# Altium schematic sheet External Connectors.SchDoc
size A3; SheetNumber: 3; SheetTotal: 4
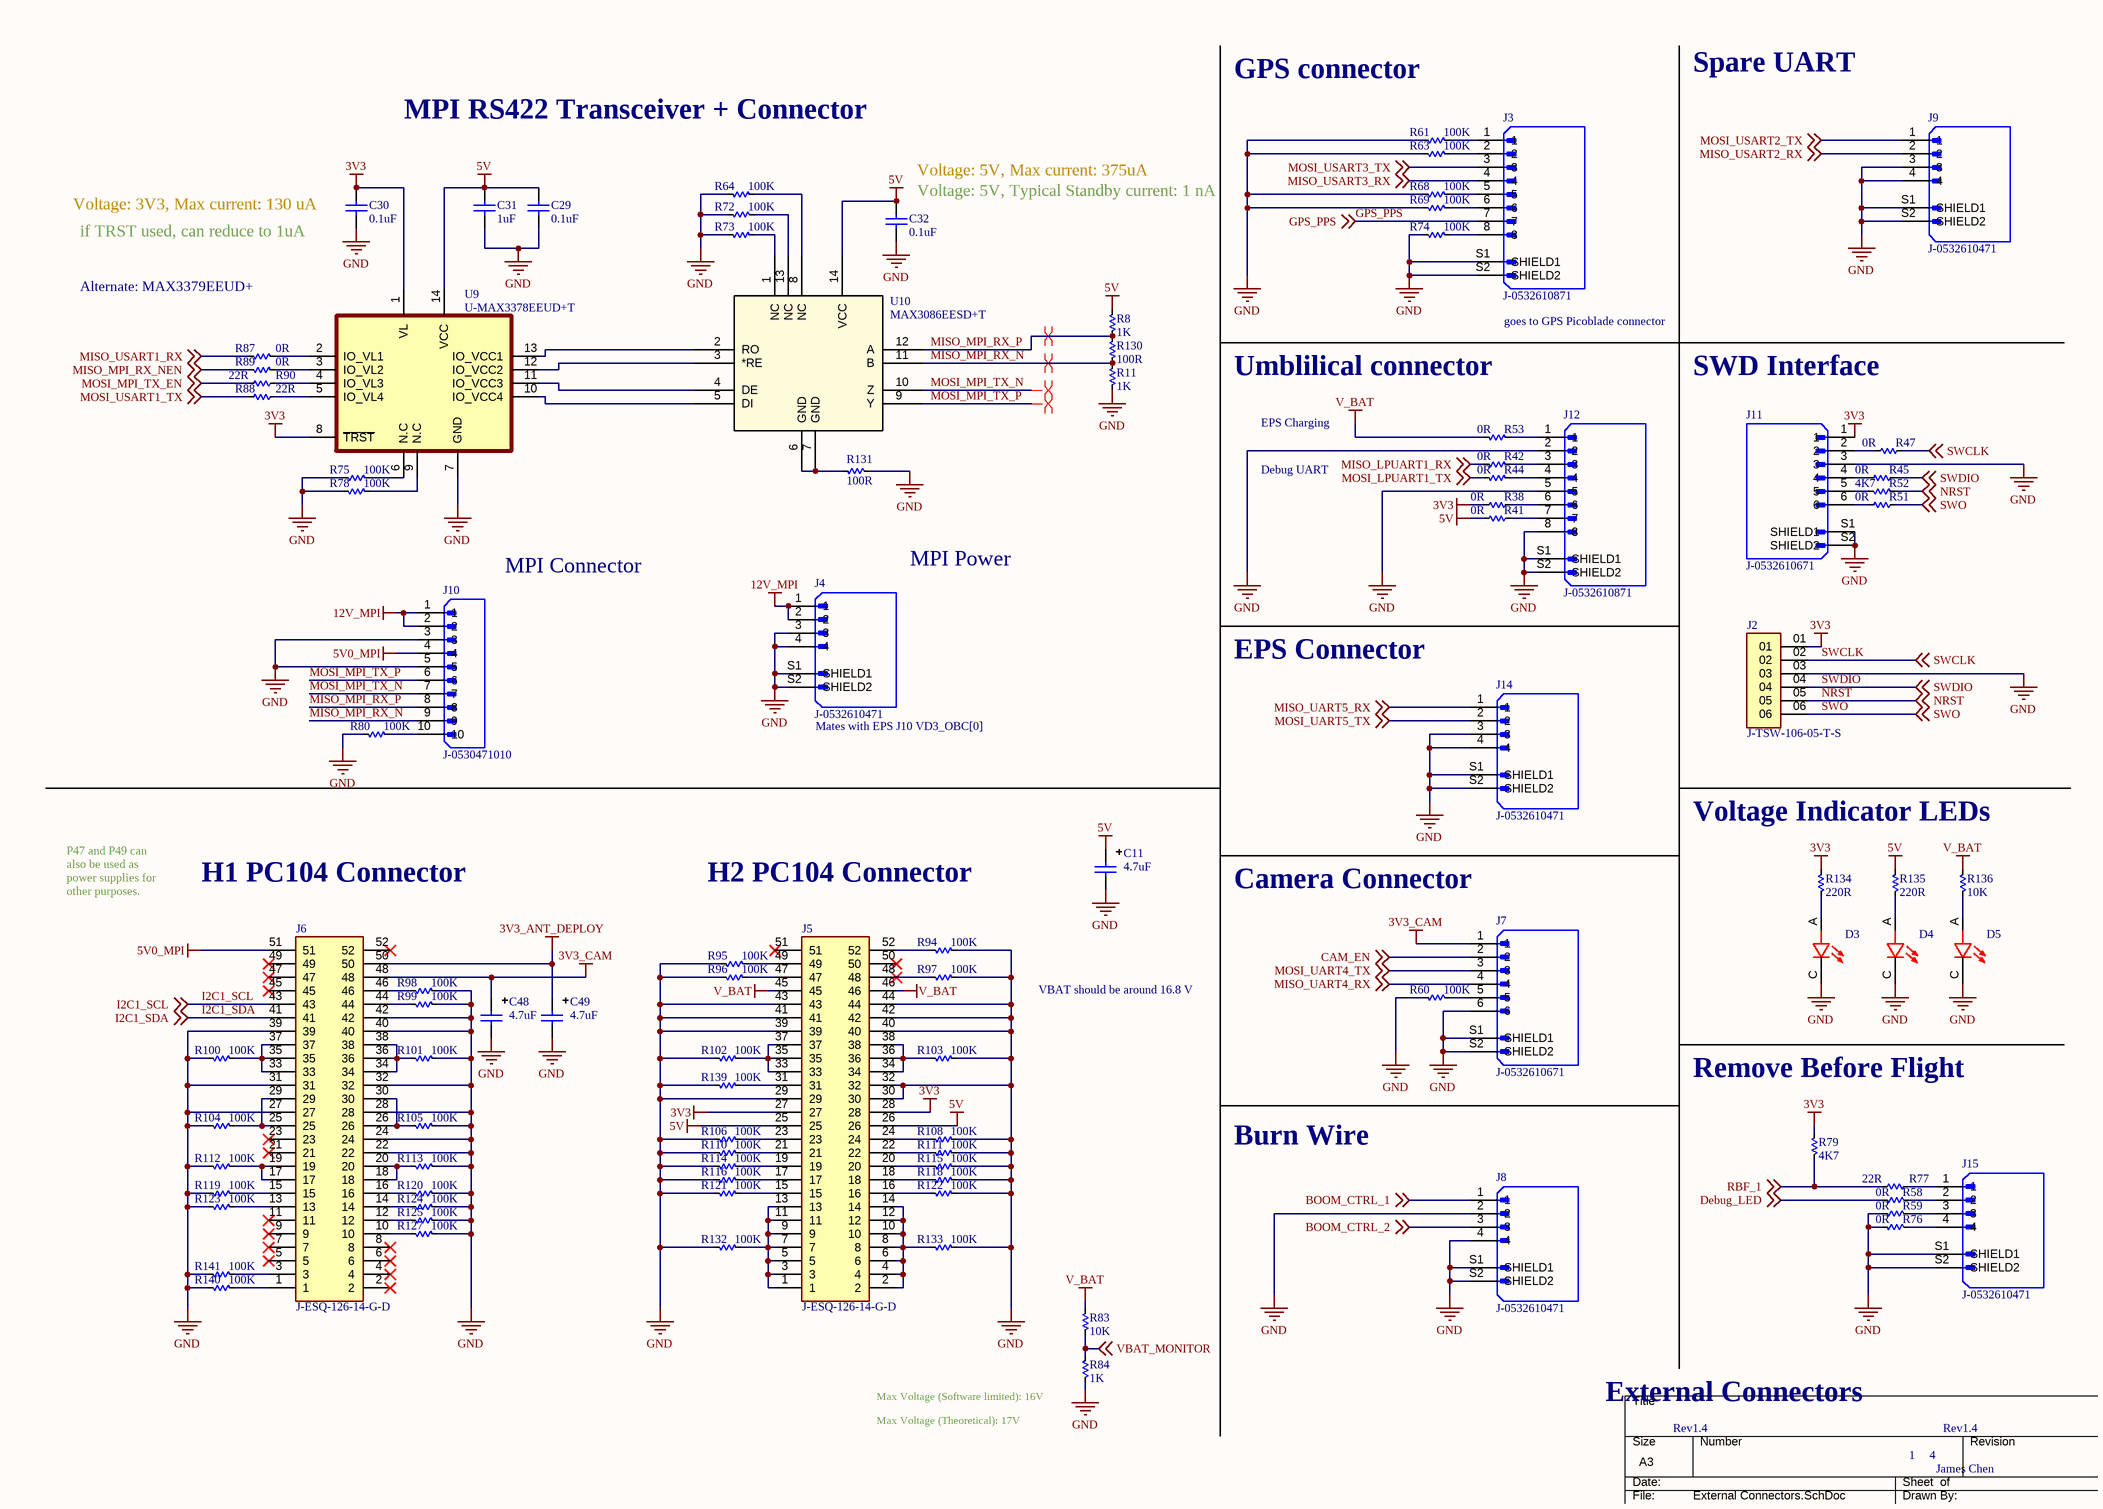
[diagram p0: External Connectors.SchDoc]

## Parts
C11  4.7uF  [CAP TANT 1206 (A) TCJ]
C29  0.1uF  [0603]
C30  0.1uF  [0603]
C31  1uF  [0603]
C32  0.1uF  [0603]
C48  4.7uF  [CAP TANT 1206 (A) TCJ]
C49  4.7uF  [CAP TANT 1206 (A) TCJ]
D3  D-SML-D12U1WT86  [D-SML-D12U1WT86]  (value not drawn)
D4  D-SML-D12U1WT86  [D-SML-D12U1WT86]  (value not drawn)
D5  D-SML-D12U1WT86  [D-SML-D12U1WT86]  (value not drawn)
J2  J-TSW-106-05-T-S  [J-TSW-106-05-T-S]
J3  J-0532610871  [J-532610871]
J4  J-0532610471  [J-53261-0471]
J5  J-ESQ-126-14-G-D  [J-ESQ-126-14-G-D]
J6  J-ESQ-126-14-G-D  [J-ESQ-126-14-G-D]
J7  J-0532610671  [J-0532610671]
J8  J-0532610471  [J-53261-0471]
J9  J-0532610471  [J-53261-0471]
J10  J-0530471010  [J-0530471010]
J11  J-0532610671  [J-0532610671]
J12  J-0532610871  [J-532610871]
J14  J-0532610471  [J-53261-0471]
J15  J-0532610471  [J-53261-0471]
R8  1K  [0603]
R11  1K  [0603]
R38  0R  [0603]
R41  0R  [0603]
R42  0R  [0603]
R44  0R  [0603]
R45  0R  [0603]
R47  0R  [0603]
R51  0R  [0603]
R52  4K7  [0603]
R53  0R  [0603]
R58  0R  [0603]
R59  0R  [0603]
R60  100K  [0603]  (value not drawn)
R61  100K  [0603]  (value not drawn)
R63  100K  [0603]  (value not drawn)
R64  100K  [0603]  (value not drawn)
R68  100K  [0603]  (value not drawn)
R69  100K  [0603]  (value not drawn)
R72  100K  [0603]  (value not drawn)
R73  100K  [0603]  (value not drawn)
R74  100K  [0603]  (value not drawn)
R75  100K  [0603]  (value not drawn)
R76  0R  [0603]
R77  22R  [0603]
R78  100K  [0603]  (value not drawn)
R79  4K7  [0603]
R80  100K  [0603]  (value not drawn)
R83  10K  [0603]
R84  1K  [0603]
R87  0R  [0603]
R88  22R  [0603]
R89  0R  [0603]
R90  22R  [0603]
R94  100K  [0603]  (value not drawn)
R95  100K  [0603]  (value not drawn)
R96  100K  [0603]  (value not drawn)
R97  100K  [0603]  (value not drawn)
R98  100K  [0603]  (value not drawn)
R99  100K  [0603]  (value not drawn)
R100  100K  [0603]  (value not drawn)
R101  100K  [0603]  (value not drawn)
R102  100K  [0603]  (value not drawn)
R103  100K  [0603]  (value not drawn)
R104  100K  [0603]  (value not drawn)
R105  100K  [0603]  (value not drawn)
R106  100K  [0603]  (value not drawn)
R108  100K  [0603]  (value not drawn)
R110  100K  [0603]  (value not drawn)
R111  100K  [0603]  (value not drawn)
R112  100K  [0603]  (value not drawn)
R113  100K  [0603]  (value not drawn)
R114  100K  [0603]  (value not drawn)
R115  100K  [0603]  (value not drawn)
R116  100K  [0603]  (value not drawn)
R118  100K  [0603]  (value not drawn)
R119  100K  [0603]  (value not drawn)
R120  100K  [0603]  (value not drawn)
R121  100K  [0603]  (value not drawn)
R122  100K  [0603]  (value not drawn)
R123  100K  [0603]  (value not drawn)
R124  100K  [0603]  (value not drawn)
R125  100K  [0603]  (value not drawn)
R127  100K  [0603]  (value not drawn)
R130  100R  [0603]
R131  100R  [0603]
R132  100K  [0603]  (value not drawn)
R133  100K  [0603]  (value not drawn)
R134  220R  [0603]
R135  220R  [0603]
R136  10K  [0603]
R139  100K  [0603]  (value not drawn)
R140  100K  [0603]  (value not drawn)
R141  100K  [0603]  (value not drawn)
U9  U-MAX3378EEUD+T  [U-MAX3378EEUD+T]
U10  MAX3086EESD+T  [U-MAX3086EESD+T]

## Nets
3V3: C30.1 J2.01 J5.27 J5.28 J11.1 R38.2 R79.2 R134.2 U9.1(VL) U9.8(~{TRST})
3V3_ANT_DEPLOY: C49.1 J6.50
3V3_CAM: C48.1 J6.48 J7.1
5V: C11.1 C29.1 C31.2 C32.1 J5.25 J5.26 R8.2 R41.2 R135.2 U9.14(VCC) U10.14(VCC)
5V0_MPI: J6.51 J10.4
12V_MPI: J4.1 J4.2 J10.1 J10.2
GND: C11.2 C29.2 C30.2 C31.1 C32.2 C48.2 C49.2 D3.C D4.C D5.C J2.03 J3.S1(SHIELD1) J3.S2(SHIELD2) J4.3 J4.4 J4.S1(SHIELD1) J4.S2(SHIELD2) J5.29 J5.30 J5.32 J5.39 J5.40 J5.41 J5.42 J5.43 J5.44 J6.22 J6.24 J6.27 J6.28 J6.31 J6.32 J6.39 J6.40 J6.42 J7.6 J7.S1(SHIELD1) J7.S2(SHIELD2) J8.2 J8.4 J8.S1(SHIELD1) J8.S2(SHIELD2) J9.3 J9.4 J9.S1(SHIELD1) J9.S2(SHIELD2) J10.3 J10.5 J11.3 J11.S1(SHIELD1) J11.S2(SHIELD2) J12.2 J12.5 J12.8 J12.S1(SHIELD1) J12.S2(SHIELD2) J14.3 J14.4 J14.S1(SHIELD1) J14.S2(SHIELD2) J15.S1(SHIELD1) J15.S2(SHIELD2) R11.1 R59.1 R60.1 R61.1 R63.1 R64.1 R68.1 R69.1 R72.1 R73.1 R74.1 R75.1 R76.1 R78.1 R80.1 R84.1 R94.2 R95.1 R96.1 R97.2 R98.2 R99.2 R100.1 R101.2 R102.1 R103.2 R104.1 R105.2 R106.1 R108.2 R110.1 R111.2 R112.1 R113.2 R114.1 R115.2 R116.1 R118.2 R119.1 R120.2 R121.1 R122.2 R123.1 R124.2 R125.2 R127.2 R131.1 R132.1 R133.2 R139.1 R140.1 R141.1 U9.7(GND)
V_BAT: J5.45 J5.46 R53.1 R83.2 R136.2
BOOM_CTRL_1: J8.1 ; off-sheet BOOM_CTRL_1
BOOM_CTRL_2: J8.3 ; off-sheet BOOM_CTRL_2
CAM_EN: J7.2 ; off-sheet CAM_EN
Debug_LED: R58.1 ; off-sheet Debug_LED
GPS_PPS: J3.7 ; off-sheet GPS_PPS
I2C1_SCL: J6.43 ; off-sheet I2C1_SCL
I2C1_SDA: J6.41 ; off-sheet I2C1_SDA
MISO_LPUART1_RX: R42.1 ; off-sheet MISO_LPUART1_RX
MISO_MPI_RX_N: J10.9 R11.2 R130.1 U10.11(B)
MISO_MPI_RX_NEN: R89.1 ; off-sheet MISO_MPI_RX_NEN
MISO_MPI_RX_P: J10.8 R8.1 R130.2 U10.12(A)
MISO_UART4_RX: J7.4 ; off-sheet MISO_UART4_RX
MISO_UART5_RX: J14.1 ; off-sheet MISO_UART5_RX
MISO_USART1_RX: R87.1 ; off-sheet MISO_USART1_RX
MISO_USART2_RX: J9.2 ; off-sheet MISO_USART2_RX
MISO_USART3_RX: J3.4 ; off-sheet MISO_USART3_RX
MOSI_LPUART1_TX: R44.1 ; off-sheet MOSI_LPUART1_TX
MOSI_MPI_TX_EN: R90.1 ; off-sheet MOSI_MPI_TX_EN
MOSI_MPI_TX_N: J10.7 U10.10(Z)
MOSI_MPI_TX_P: J10.6 U10.9(Y)
MOSI_UART4_TX: J7.3 ; off-sheet MOSI_UART4_TX
MOSI_UART5_TX: J14.2 ; off-sheet MOSI_UART5_TX
MOSI_USART1_TX: R88.2 ; off-sheet MOSI_USART1_TX
MOSI_USART2_TX: J9.1 ; off-sheet MOSI_USART2_TX
MOSI_USART3_TX: J3.3 ; off-sheet MOSI_USART3_TX
NRST: J2.05 R52.1 ; off-sheet NRST
RBF_1: R77.1 R79.1 ; off-sheet RBF_1
SWCLK: J2.02 R47.1 ; off-sheet SWCLK
SWDIO: J2.04 R45.1 ; off-sheet SWDIO
SWO: J2.06 R51.1 ; off-sheet SWO
VBAT_MONITOR: R83.1 R84.2 ; off-sheet VBAT_MONITOR
NetD3_A: D3.A R134.1
NetD4_A: D4.A R135.1
NetD5_A: D5.A R136.1
NetJ3_1: J3.1 R61.2
NetJ3_2: J3.2 R63.2
NetJ3_5: J3.5 R68.2
NetJ3_6: J3.6 R69.2
NetJ3_8: J3.8 R74.2
NetJ5_1: J5.1 J5.3 J5.5 J5.7 J5.9 J5.11 J5.13 R132.2
NetJ5_2: J5.2 J5.4 J5.6 J5.8 J5.10 J5.12 J5.14 R133.1
NetJ5_15: J5.15 R121.2
NetJ5_16: J5.16 R122.1
NetJ5_17: J5.17 R116.2
NetJ5_18: J5.18 R118.1
NetJ5_19: J5.19 R114.2
NetJ5_20: J5.20 R115.1
NetJ5_21: J5.21 R110.2
NetJ5_22: J5.22 R111.1
NetJ5_23: J5.23 R106.2
NetJ5_24: J5.24 R108.1
NetJ5_31: J5.31 R139.2
NetJ5_33: J5.33 J5.35 J5.37 R102.2
NetJ5_34: J5.34 J5.36 J5.38 R103.1
NetJ5_47: J5.47 R96.2
NetJ5_48: J5.48 R97.1
NetJ5_49: J5.49 R95.2
NetJ5_52: J5.52 R94.1
NetJ6_1: J6.1 R140.2
NetJ6_3: J6.3 R141.2
NetJ6_10: J6.10 R127.1
NetJ6_12: J6.12 R125.1
NetJ6_13: J6.13 R123.2
NetJ6_14: J6.14 R124.1
NetJ6_15: J6.15 R119.2
NetJ6_16: J6.16 R120.1
NetJ6_17: J6.17 J6.19 R112.2
NetJ6_18: J6.18 J6.20 R113.1
NetJ6_25: J6.25 J6.29 R104.2
NetJ6_26: J6.26 J6.30 R105.1
NetJ6_33: J6.33 J6.35 J6.37 R100.2
NetJ6_34: J6.34 J6.36 J6.38 R101.1
NetJ6_44: J6.44 R99.1
NetJ6_46: J6.46 R98.1
NetJ7_5: J7.5 R60.2
NetJ10_10: J10.10 R80.2
NetJ11_2: J11.2 R47.2
NetJ11_4: J11.4 R45.2
NetJ11_5: J11.5 R52.2
NetJ11_6: J11.6 R51.2
NetJ12_1: J12.1 R53.2
NetJ12_3: J12.3 R42.2
NetJ12_4: J12.4 R44.2
NetJ12_6: J12.6 R38.1
NetJ12_7: J12.7 R41.1
NetJ15_1: J15.1 R77.2
NetJ15_2: J15.2 R58.2
NetJ15_3: J15.3 R59.2
NetJ15_4: J15.4 R76.2
NetR64_2: R64.2 U10.8(NC)
NetR72_2: R72.2 U10.13(NC)
NetR73_2: R73.2 U10.1(NC)
NetR75_2: R75.2 U9.6(N.C)
NetR78_2: R78.2 U9.9(N.C)
NetR87_2: R87.2 U9.2(IO_VL1)
NetR88_1: R88.1 U9.5(IO_VL4)
NetR89_2: R89.2 U9.3(IO_VL2)
NetR90_2: R90.2 U9.4(IO_VL3)
NetR131_2: R131.2 U10.6(GND) U10.7(GND)
NetU9_10: U9.10(IO_VCC4) U10.5(DI)
NetU9_11: U9.11(IO_VCC3) U10.4(DE)
NetU9_12: U9.12(IO_VCC2) U10.3(*RE)
NetU9_13: U9.13(IO_VCC1) U10.2(RO)

Not connected (* = marked no-connect by the designer): J5 50* 51*; J6 2* 4* 5* 6* 7* 8* 9* 11* 21* 23* 45* 47* 49* 52*

## Layout directives
differential pair; net class DIF 100 OHMS: MISO_MPI_RX_N, MISO_MPI_RX_P, MOSI_MPI_TX_N, MOSI_MPI_TX_P

## Notes on the sheet
- GPS connector
- Spare UART
- MPI RS422 Transceiver + Connector
- (near C32) Voltage: 5V, Max current: 375uA
- (near C30) Voltage: 3V3, Max current: 130 uA
- (near C30) if TRST used, can reduce to 1uA
- (near C32) Voltage: 5V, Typical Standby current: 1 nA
- Alternate: MAX3379EEUD+
- Umblilical connector
- (near J3) goes to GPS Picoblade connector
- SWD Interface
- EPS Charging
- Debug UART
- (near J10) MPI Connector
- (near J4) MPI Power
- EPS Connector
- (near J4) Mates with EPS J10 VD3_OBC[0]
- Voltage Indicator LEDs
- P47 and P49 can also be used as power supplies for other purposes.
- H1 PC104 Connector
- H2 PC104 Connector
- Camera Connector
- VBAT should be around 16.8 V
- (near R79) Remove Before Flight
- Burn Wire
- (near R84) Max Voltage (Software limited): 16V
  Max Voltage (Theoretical): 17V
- External Connectors
- Rev1.4
- 1
- 4
- James Chen
- THIS DOCUMENT AND THE DATA DISCLOSED HEREIN OR
- HEREWITH IS THE PROPERTY OF ALTIUM LIMITED AND MAY
- DWG NO:
- REVISION
- REV:
- DESCRIPTION
- DATE
- APPROVED
- BE FREELY DISTRIBUTED IN WHOLE. NO RIGHTS ARE
- RESERVED OR EXPRESS OR IMPLIED WARANTEE GIVEN.
- ENG:
- APPROVALS
- PROJECT
- DSN:
- CHK:
- REFERENCE DOCUMENTS
- PROJECT REVISION:
- TITLE
- DOCUMENT REVISION:
- DESIGN ITEM:
- BOM:
- FAB DWG:
- PCB DWG:
- ASSY DWG:
- SCALE:
- A3
- SIZE
- CAGE CODE
- FILE NAME
- DWG NO.
- SHEET
- OF
- REV

## Library data of the parts
C11 C48 C49 = CT-474-M-20V-OTH-1206: 4.7 µF Molded Tantalum Capacitors 20 V 1206 (3216 Metric) 4Ohm; Manufacturer: AVX Corporation; Manufacturer Part #: TAJA475K020RNJ; ComponentLink1Description: Datasheet; ComponentLink1URL: *; ComponentLink2Description: Manufacturer Website; ComponentLink2URL: *; Distributor: Digikey; Distributor Part #: 478-1668-1-ND; Part Description: 4.7 µF Molded Tantalum Capacitors 20 V 1206 (3216 Metric) 4Ohm; Value: 4.7uF
C29 C30 C32 = CC-100nF-25V-X7R-0603: 25V 100nF X7R ±10% 0603 Multilayer Ceramic Capacitors MLCC - SMD/SMT ROHS; Manufacturer: Murata Electronics; Manufacturer Part #: GCJ188R71E104KA12D; Max Exposed Voltage: 6; Rated Voltage: 25; ComponentLink1description: Datasheet; ComponentLink1URL: https://ds.yuden.co.jp/TYCOMPAS/ut/detail?pn=TMK105BJ104KV-F%20%20&u=M; ComponentLink2description: Manufacturer Website; Distributor: LCSC; Distributor Part #: C354391; Part Description: 25V 100nF X7R ±10% 0603 Multilayer Ceramic Capacitors MLCC - SMD/SMT ROHS; ComponentLink2URL: https://www.yuden.co.jp/or/; Value: 0.1uF; Highest Rated Operating Temperature: 125; Lowest Rated Operating Temperature: -55
C31 = CC-105-K-25V-X7R-0603: CAP CER 1UF 25V X7R 0603; Manufacturer: Yageo; Manufacturer Part #: CC0603KRX7R8BB105; ComponentLink1Description: Datasheet; ComponentLink1URL: https://www.yageo.com/upload/media/product/productsearch/datasheet/mlcc/UPY-GPHC_X7R_6.3V-to-50V_18.pdf; ComponentLink2Description: Manufacture Website; ComponentLink2URL: https://www.yageo.com/en/Home; Distributor: Digikey; Distributor Part #: 311-1802-1-ND; Part Description: CAP CER 1UF 25V X7R 0603; SignalCraft Part #: CC-105-K-25V-X7R-0603; Value: 1uF
D3-D5 = D-SML-D12U1WT86: Red 620nm LED Indication - Discrete 2.2V 0603 _1608 Metric; Manufacturer: Rohm Semiconductor; Manufacturer Part #: SML-D12U1WT86; Distributor: Digikey; Distributor Part #: SML-D12U1WT86CT-ND
J2 = J-TSW-106-05-T-S: CONN HEADER VERT 6POS 2.54MM; Distrbutor part #: SAM12323-ND; Manufacturer: Samtec; Distrbutor: None; Manufacturer Part #: TSW-106-05-T-S; Price: None
J3 J12 = J-0532610871: CONN HEADER SMD R/A 8POS 1.25MM; Manfacturer: Molex; Manfacturer Part #: 0532610871; Distributor Part #: WM7626CT-ND; Distributor: Digi-Key
J4 J8 J9 J14 J15 = J-0532610471: CONN HEADER SMD R/A 4POS 1.25MM; Manfacturer: Molex; Manfacturer Part #: 0532610471; Distributor Part #: WM7622CT-ND; Distributor: Digi-Key
J5 J6 = J-ESQ-126-14-G-D: CONN SOCKET 52POS 0.1 GOLD PCB; Manufacturer: Samtec Inc.; Manufacturer Part #: ESQ-126-14-G-D; Distributor: Digikey; Distributor Part #: SAM11114-ND
J7 J11 = J-0532610671: CONN HEADER SMD R/A 6POS 1.25MM; Manfacturer: Molex; Distributor: Digi-Key; Manfacturer Part #: 0532610671; Distributor Part #: WM7624CT-ND
J10 = J-0530471010: CONN HEADER VERT 10POS 1.25MM; Manufacturer: Molex; Manufacturer Part #: 0530471010; Distributor: Digikey; Distributor Part #: WM1739-ND
R8 R11 R84 = RT-1K0-F-1/16W-0603: RES SMD 1K OHM 1% 1/16W 0603; Manufacturer: TE Connectivity Passive Product; Manufacturer Part #: CPF0603F1K0C1; ComponentLink1description: Datasheet; ComponentLink1URL: https://www.vishay.com/docs/20035/dcrcwe3.pdf; ComponentLink2description: Manufacturer Website; Distributor: Digikey; Distributor Part #: A102226CT-ND; Part Description: RES SMD 1K OHM 1% 1/16W 0603; ComponentLink2URL: https://www.vishay.com/; Value: 1K
R38 R41 R42 R44 R45 R47 R51 R53 R58 R59 R76 R87 R89 = RT-0R00-F-1/10W-0603: 0 Ohms Jumper 0.1W, 1/10W Chip Resistor 0603 (1608 Metric) Automotive AEC-Q200 Thick Film; Manufacturer: Stackpole Electronics Inc; Manufacturer Part #: RMCF0603ZT0R00; ComponentLink1description: Datasheet; ComponentLink1URL: https://industrial.panasonic.com/ww/products/resistors/chip-resistors/general-purpose-chip-resistors/models/ERJ2GE0R00X; ComponentLink2description: Manufacturer Website; Distributor: Digikey; Distributor Part #: RMCF0603ZT0R00CT-ND; Part Description: 0 Ohms Jumper 0.1W, 1/10W Chip Resistor 0603 (1608 Metric) Automotive AEC-Q200 Thick Film; ComponentLink2URL: https://industrial.panasonic.com/ww/products/resistors/chip-resistors/general-purpose-chip-resistors/models/ERJ2GE0R00X; Value: 0R
R52 R79 = RT-4K7-F-1/16W-0603: RES SMD 4.7K OHM 1% 1/10W 0603; Manufacturer: Bourns Inc.; Manufacturer Part #: CR0603-FX-4701ELF; ComponentLink1description: Datasheet; ComponentLink1URL: https://www.vishay.com/docs/20035/dcrcwe3.pdf; ComponentLink2description: Manufacturer Website; Distributor: Digikey; Distributor Part #: CR0603-FX-4701ELFCT-ND; Part Description: RES SMD 4.7K OHM 1% 1/10W 0603; ComponentLink2URL: https://www.vishay.com/; Value: 4K7
R60 R61 R63 R64 R68 R69 R72-R75 R78 R80 R94-R106 R108 R110-R116 R118-R125 R127 R132 R133 R139-R141 = RT-100K0-F-1/16W-0603: RES SMD 100KΩ 0.1% 1/16W 0603; Manufacturer: TE Connectivity; Manufacturer Part #: CPF0603B100KE; ComponentLink2URL: https://www.te.com/commerce/DocumentDelivery/DDEController?Action=showdoc&DocId=Data+Sheet%7F1773200%7FM%7Fpdf%7FEnglish%7FENG_DS_1773200_M.pdf%7F3-1676481-2; ComponentLink2Description: Datasheet; Distributor: Digikey; Distributor Part #: A119912CT-ND; Part Description: RES SMD 100KΩ 0.1% 1/16W 0603; Value: 100K
R77 R88 R90 = RT-22R0-F-1/16W-0603: 22 Ohms ±0.5% 0.063W, 1/16W Chip Resistor 0603 (1608 Metric) - Thin Film; Manufacturer: Susumu; Manufacturer Part #: RR0816Q-220-D; ComponentLink1description: Datasheet; ComponentLink1URL: https://www.vishay.com/docs/20035/dcrcwe3.pdf; ComponentLink2description: Manufacturer Website; Distributor: Digikey; Distributor Part #: RR08Q22DCT-ND; Part Description: 22 Ohms ±0.5% 0.063W, 1/16W Chip Resistor 0603 (1608 Metric) - Thin Film; ComponentLink2URL: https://www.vishay.com/; Value: 22R
R83 = RT-10K0-F-1/16W-0603: RES 10K OHM 1% 1/8W 0603; Manufacturer: Stackpole Electronics Inc; Manufacturer Part #: RNCP0603FTD10K0; ComponentLink1description: Datasheet; ComponentLink1URL: https://www.vishay.com/docs/20035/dcrcwe3.pdf; ComponentLink2description: Manufacturer Website; Distributor: Digikey; Distributor Part #: RNCP0603FTD10K0CT-ND; Part Description: RES 10K OHM 1% 1/8W 0603; ComponentLink2URL: https://www.vishay.com/; Value: 10K
R130 R131 = RT-100R-F-1/16W-0603: RES SMD 100 OHM 0.5% 1/16W 0603; Manufacturer: Susumu; Manufacturer Part #: RR08P100DCT-ND; Distributor: Digikey; Distributor Part #: RR08P100DCT-ND; Part Description: RES SMD 100 OHM 0.5% 1/16W 0603; Value: 100R
R134 R135 = RT-220R-F-1/16W-0603: 220 Ohms ±0.5% 0.063W, 1/16W Chip Resistor 0603 (1608 Metric) - Thin Film; Manufacturer: Susumu; Manufacturer Part #: RR0816P-221-D; Distributor: Digikey; Distributor Part #: RR08P220DCT-ND; Part Description: 220 Ohms ±0.5% 0.063W, 1/16W Chip Resistor 0603 (1608 Metric) - Thin Film; Value: 220R
R136 = RT-10K0-F-1/16W-0603: 10 kOhms ±0.1% 0.063W, 1/16W Chip Resistor 0603 (1608 Metric) - Thin Film; Manufacturer: TE Connectivity Passive Product; Manufacturer Part #: CPF0603B10KE; ComponentLink1description: Datasheet; ComponentLink1URL: https://www.vishay.com/docs/20035/dcrcwe3.pdf; ComponentLink2description: Manufacturer Website; Distributor: Digikey; Distributor Part #: A119886CT-ND; Part Description: 10 kOhms ±0.1% 0.063W, 1/16W Chip Resistor 0603 (1608 Metric) - Thin Film; ComponentLink2URL: https://www.vishay.com/; Value: 10K
U9 = U-MAX3378EEUD+T: IC TRNSLTR BIDIRECTIONAL 14TSSOP; Manufacturer: Maxim Integrated; Manufacturer Part #: MAX3378EEUD+T; Distributor: Digikey; Distributor Part #: MAX3378EEUD+TCT-ND; LCSC Part #: C143441
U10 = U-MAX3086EESD+T: IC TRANSCEIVER FULL 1/1 14SOIC; Manufacturer: Maxim Integrated Products; Manufacturer Part #: MAX3086EESD+T; Distributor: Digikey; Distributor Part #: MAX3086EESD+TCT-ND; Type: DEV; LCSC Part #: C2671104